# Altium schematic sheet IMX8_PWR.SchDoc
size 594 x 420 mm; SheetNumber: 2; SheetTotal: 7
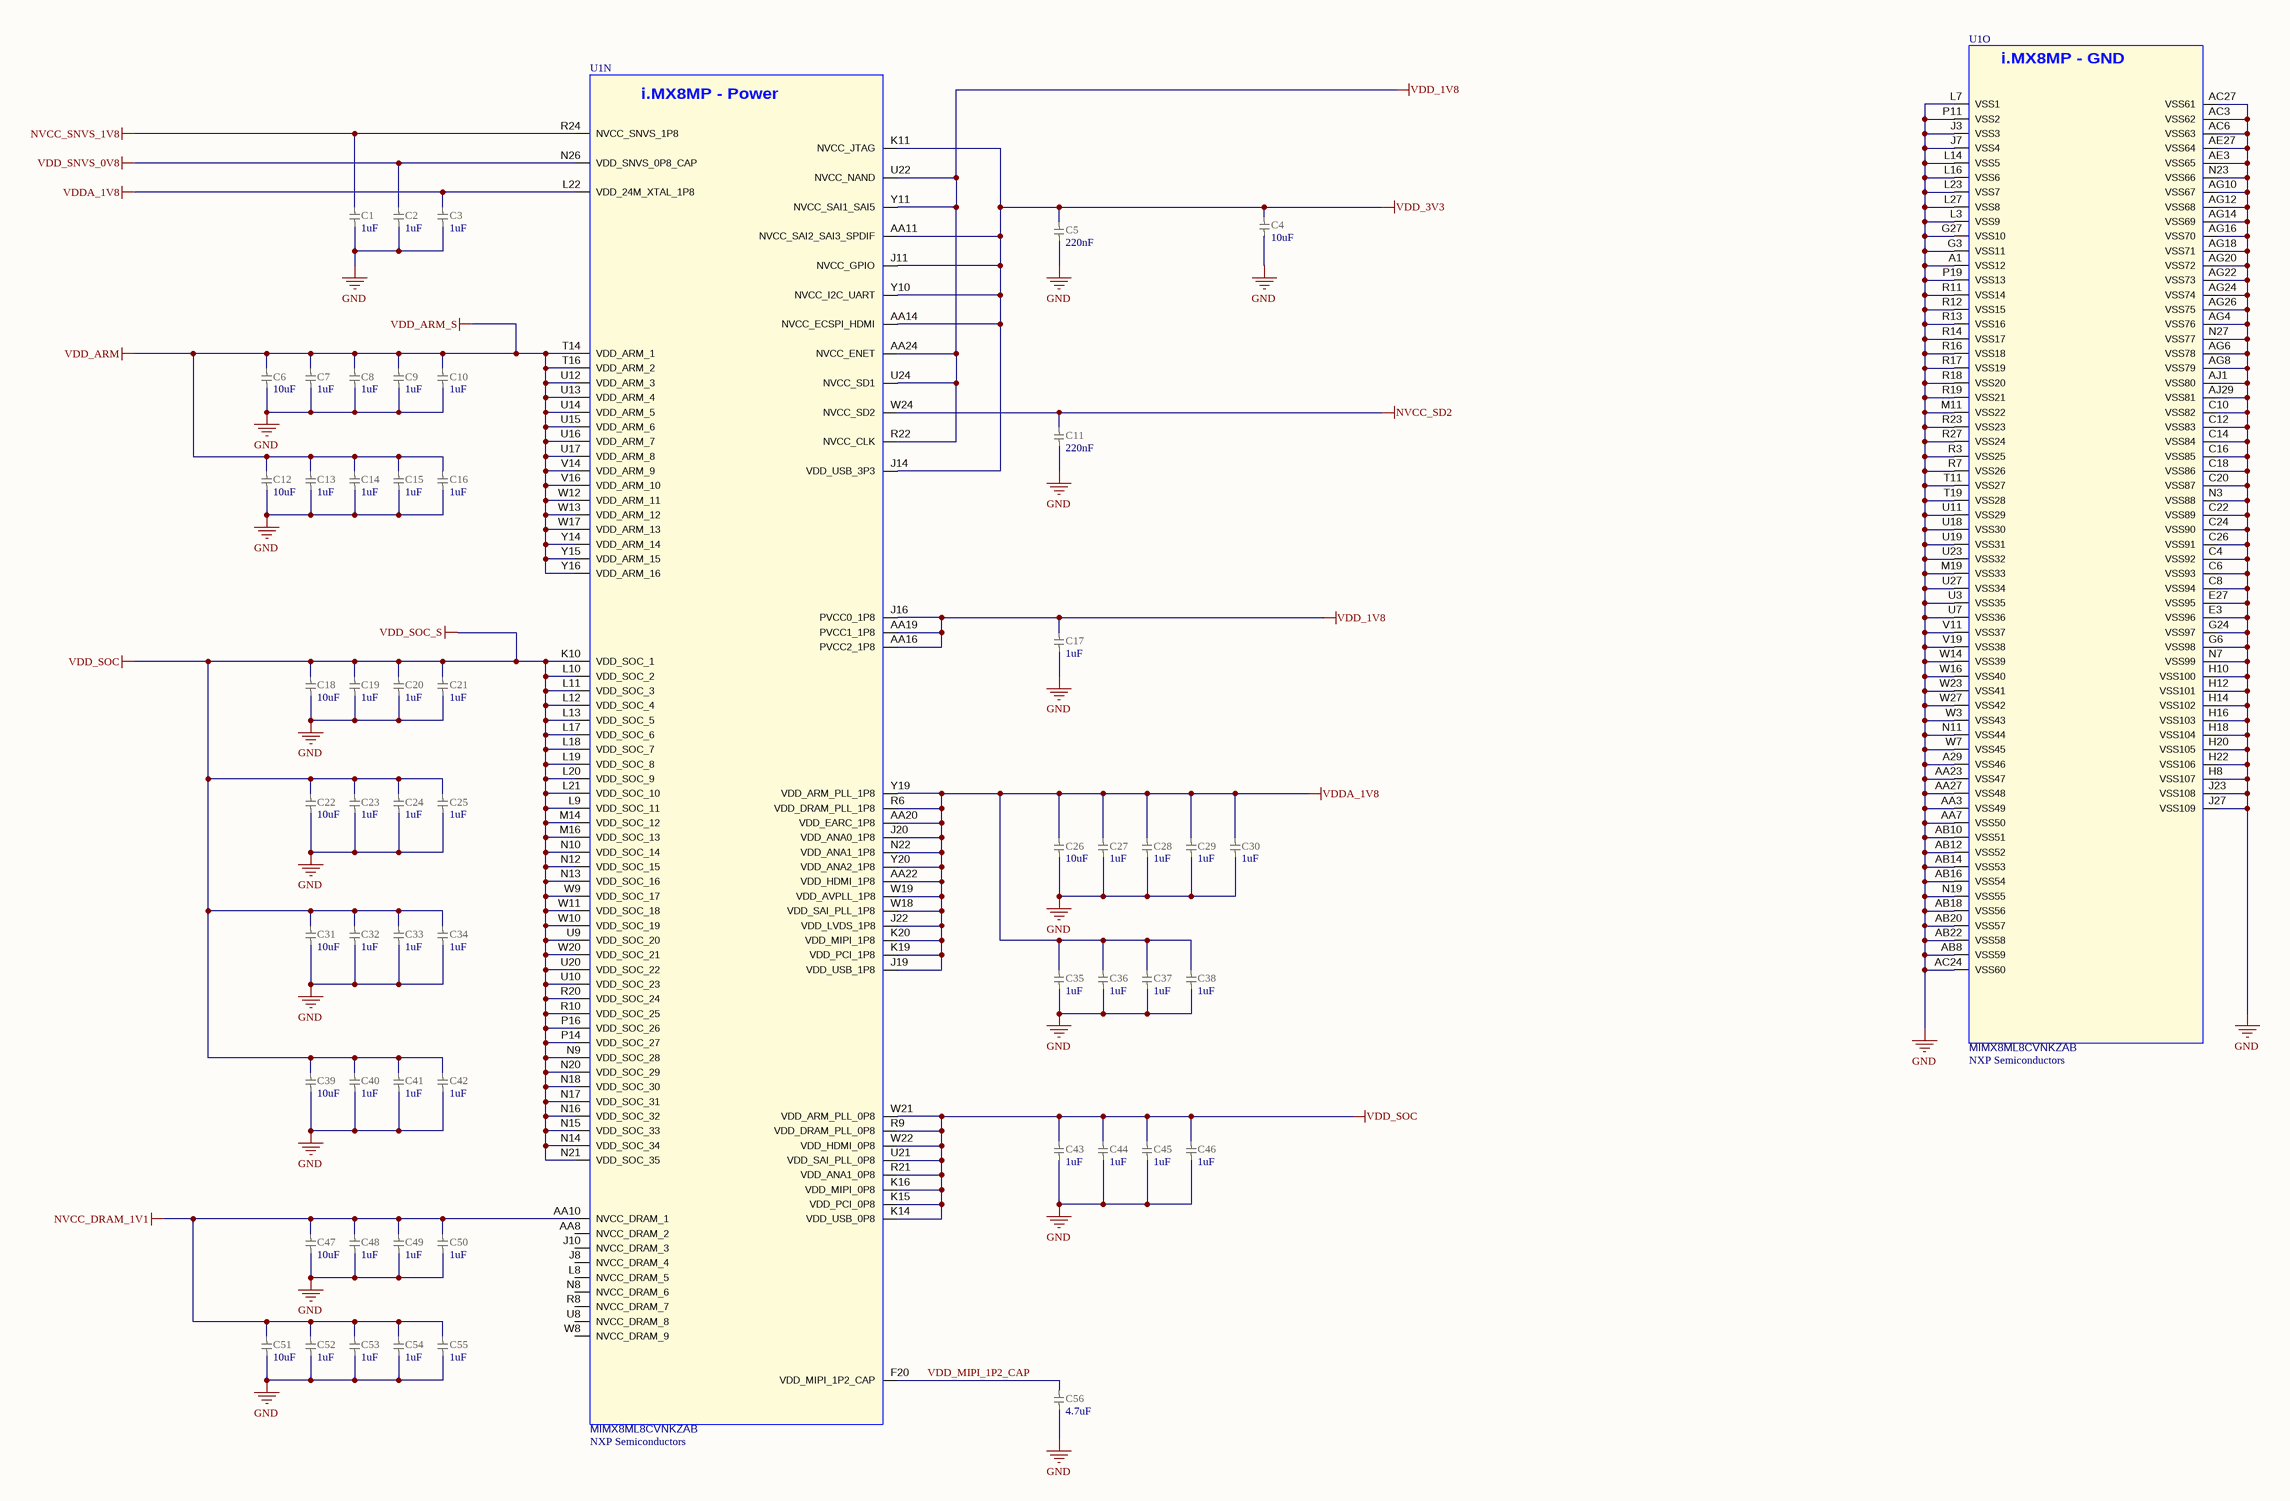
[diagram p0: IMX8_PWR.SchDoc]

## Parts
C1  value 1uF  [CAP_0201_UN1Q]  (hidden comment: CAP_0201_1uF_X6S)
C2  value 1uF  [CAP_0201_UN1Q]  (hidden comment: CAP_0201_1uF_X6S)
C3  value 1uF  [CAP_0201_UN1Q]  (hidden comment: CAP_0201_1uF_X6S)
C4  value 10uF  [CAP_0402_H09W07_UN1Q]  (hidden comment: CAP_0402_10u_X6S)
C5  value 220nF  [CAP_0201_UN1Q]  (hidden comment: CAP_0201_220n_10V_X6S)
C6  value 10uF  [CAP_0402_H09W07_UN1Q]  (hidden comment: CAP_0402_10u_X6S)
C7  value 1uF  [CAP_0201_UN1Q]  (hidden comment: CAP_0201_1uF_X6S)
C8  value 1uF  [CAP_0201_UN1Q]  (hidden comment: CAP_0201_1uF_X6S)
C9  value 1uF  [CAP_0201_UN1Q]  (hidden comment: CAP_0201_1uF_X6S)
C10  value 1uF  [CAP_0201_UN1Q]  (hidden comment: CAP_0201_1uF_X6S)
C11  value 220nF  [CAP_0201_UN1Q]  (hidden comment: CAP_0201_220n_10V_X6S)
C12  value 10uF  [CAP_0402_H09W07_UN1Q]  (hidden comment: CAP_0402_10u_X6S)
C13  value 1uF  [CAP_0201_UN1Q]  (hidden comment: CAP_0201_1uF_X6S)
C14  value 1uF  [CAP_0201_UN1Q]  (hidden comment: CAP_0201_1uF_X6S)
C15  value 1uF  [CAP_0201_UN1Q]  (hidden comment: CAP_0201_1uF_X6S)
C16  value 1uF  [CAP_0201_UN1Q]  (hidden comment: CAP_0201_1uF_X6S)
C17  value 1uF  [CAP_0201_UN1Q]  (hidden comment: CAP_0201_1uF_X6S)
C18  value 10uF  [CAP_0402_H09W07_UN1Q]  (hidden comment: CAP_0402_10u_X6S)
C19  value 1uF  [CAP_0201_UN1Q]  (hidden comment: CAP_0201_1uF_X6S)
C20  value 1uF  [CAP_0201_UN1Q]  (hidden comment: CAP_0201_1uF_X6S)
C21  value 1uF  [CAP_0201_UN1Q]  (hidden comment: CAP_0201_1uF_X6S)
C22  value 10uF  [CAP_0402_H09W07_UN1Q]  (hidden comment: CAP_0402_10u_X6S)
C23  value 1uF  [CAP_0201_UN1Q]  (hidden comment: CAP_0201_1uF_X6S)
C24  value 1uF  [CAP_0201_UN1Q]  (hidden comment: CAP_0201_1uF_X6S)
C25  value 1uF  [CAP_0201_UN1Q]  (hidden comment: CAP_0201_1uF_X6S)
C26  value 10uF  [CAP_0402_H09W07_UN1Q]  (hidden comment: CAP_0402_10u_X6S)
C27  value 1uF  [CAP_0201_UN1Q]  (hidden comment: CAP_0201_1uF_X6S)
C28  value 1uF  [CAP_0201_UN1Q]  (hidden comment: CAP_0201_1uF_X6S)
C29  value 1uF  [CAP_0201_UN1Q]  (hidden comment: CAP_0201_1uF_X6S)
C30  value 1uF  [CAP_0201_UN1Q]  (hidden comment: CAP_0201_1uF_X6S)
C31  value 10uF  [CAP_0402_H09W07_UN1Q]  (hidden comment: CAP_0402_10u_X6S)
C32  value 1uF  [CAP_0201_UN1Q]  (hidden comment: CAP_0201_1uF_X6S)
C33  value 1uF  [CAP_0201_UN1Q]  (hidden comment: CAP_0201_1uF_X6S)
C34  value 1uF  [CAP_0201_UN1Q]  (hidden comment: CAP_0201_1uF_X6S)
C35  value 1uF  [CAP_0201_UN1Q]  (hidden comment: CAP_0201_1uF_X6S)
C36  value 1uF  [CAP_0201_UN1Q]  (hidden comment: CAP_0201_1uF_X6S)
C37  value 1uF  [CAP_0201_UN1Q]  (hidden comment: CAP_0201_1uF_X6S)
C38  value 1uF  [CAP_0201_UN1Q]  (hidden comment: CAP_0201_1uF_X6S)
C39  value 10uF  [CAP_0402_H09W07_UN1Q]  (hidden comment: CAP_0402_10u_X6S)
C40  value 1uF  [CAP_0201_UN1Q]  (hidden comment: CAP_0201_1uF_X6S)
C41  value 1uF  [CAP_0201_UN1Q]  (hidden comment: CAP_0201_1uF_X6S)
C42  value 1uF  [CAP_0201_UN1Q]  (hidden comment: CAP_0201_1uF_X6S)
C43  value 1uF  [CAP_0201_UN1Q]  (hidden comment: CAP_0201_1uF_X6S)
C44  value 1uF  [CAP_0201_UN1Q]  (hidden comment: CAP_0201_1uF_X6S)
C45  value 1uF  [CAP_0201_UN1Q]  (hidden comment: CAP_0201_1uF_X6S)
C46  value 1uF  [CAP_0201_UN1Q]  (hidden comment: CAP_0201_1uF_X6S)
C47  value 10uF  [CAP_0402_H09W07_UN1Q]  (hidden comment: CAP_0402_10u_X6S)
C48  value 1uF  [CAP_0201_UN1Q]  (hidden comment: CAP_0201_1uF_X6S)
C49  value 1uF  [CAP_0201_UN1Q]  (hidden comment: CAP_0201_1uF_X6S)
C50  value 1uF  [CAP_0201_UN1Q]  (hidden comment: CAP_0201_1uF_X6S)
C51  value 10uF  [CAP_0402_H09W07_UN1Q]  (hidden comment: CAP_0402_10u_X6S)
C52  value 1uF  [CAP_0201_UN1Q]  (hidden comment: CAP_0201_1uF_X6S)
C53  value 1uF  [CAP_0201_UN1Q]  (hidden comment: CAP_0201_1uF_X6S)
C54  value 1uF  [CAP_0201_UN1Q]  (hidden comment: CAP_0201_1uF_X6S)
C55  value 1uF  [CAP_0201_UN1Q]  (hidden comment: CAP_0201_1uF_X6S)
C56  value 4.7uF  [CAP_0402_H09W07_UN1Q]  (hidden comment: CAP_0402_4u7_10V_X6S)
U1  Manufacturer: NXP Semiconductors  [BGA548C50P29X29_1500X1500X148]  (hidden comment: MIMX8ML8CVNKZAB)  (parts N,O of 15)

## Nets
GND: C1.1 C2.1 C3.1 C4.1 C5.1 C6.1 C7.1 C8.1 C9.1 C10.1 C11.1 C12.1 C13.1 C14.1 C15.1 C16.1 C17.1 C18.1 C19.1 C20.1 C21.1 C22.1 C23.1 C24.1 C25.1 C26.1 C27.1 C28.1 C29.1 C30.1 C31.1 C32.1 C33.1 C34.1 C35.1 C36.1 C37.1 C38.1 C39.1 C40.1 C41.1 C42.1 C43.1 C44.1 C45.1 C46.1 C47.1 C48.1 C49.1 C50.1 C51.1 C52.1 C53.1 C54.1 C55.1 C56.1 U1.A1(VSS12) U1.A29(VSS46) U1.AA3(VSS49) U1.AA7(VSS50) U1.AA23(VSS47) U1.AA27(VSS48) U1.AB8(VSS59) U1.AB10(VSS51) U1.AB12(VSS52) U1.AB14(VSS53) U1.AB16(VSS54) U1.AB18(VSS56) U1.AB20(VSS57) U1.AB22(VSS58) U1.AC3(VSS62) U1.AC6(VSS63) U1.AC24(VSS60) U1.AC27(VSS61) U1.AE3(VSS65) U1.AE27(VSS64) U1.AG4(VSS76) U1.AG6(VSS78) U1.AG8(VSS79) U1.AG10(VSS67) U1.AG12(VSS68) U1.AG14(VSS69) U1.AG16(VSS70) U1.AG18(VSS71) U1.AG20(VSS72) U1.AG22(VSS73) U1.AG24(VSS74) U1.AG26(VSS75) U1.AJ1(VSS80) U1.AJ29(VSS81) U1.C4(VSS92) U1.C6(VSS93) U1.C8(VSS94) U1.C10(VSS82) U1.C12(VSS83) U1.C14(VSS84) U1.C16(VSS85) U1.C18(VSS86) U1.C20(VSS87) U1.C22(VSS89) U1.C24(VSS90) U1.C26(VSS91) U1.E3(VSS96) U1.E27(VSS95) U1.G3(VSS11) U1.G6(VSS98) U1.G24(VSS97) U1.G27(VSS10) U1.H8(VSS107) U1.H10(VSS100) U1.H12(VSS101) U1.H14(VSS102) U1.H16(VSS103) U1.H18(VSS104) U1.H20(VSS105) U1.H22(VSS106) U1.J3(VSS3) U1.J7(VSS4) U1.J23(VSS108) U1.J27(VSS109) U1.L3(VSS9) U1.L7(VSS1) U1.L14(VSS5) U1.L16(VSS6) U1.L23(VSS7) U1.L27(VSS8) U1.M11(VSS22) U1.M19(VSS33) U1.N3(VSS88) U1.N7(VSS99) U1.N11(VSS44) U1.N19(VSS55) U1.N23(VSS66) U1.N27(VSS77) U1.P11(VSS2) U1.P19(VSS13) U1.R3(VSS25) U1.R7(VSS26) U1.R11(VSS14) U1.R12(VSS15) U1.R13(VSS16) U1.R14(VSS17) U1.R16(VSS18) U1.R17(VSS19) U1.R18(VSS20) U1.R19(VSS21) U1.R23(VSS23) U1.R27(VSS24) U1.T11(VSS27) U1.T19(VSS28) U1.U3(VSS35) U1.U7(VSS36) U1.U11(VSS29) U1.U18(VSS30) U1.U19(VSS31) U1.U23(VSS32) U1.U27(VSS34) U1.V11(VSS37) U1.V19(VSS38) U1.W3(VSS43) U1.W7(VSS45) U1.W14(VSS39) U1.W16(VSS40) U1.W23(VSS41) U1.W27(VSS42)
NVCC_DRAM_1V1: C47.2 C48.2 C49.2 C50.2 C51.2 C52.2 C53.2 C54.2 C55.2 U1.AA10(NVCC_DRAM_1)
NVCC_SD2: C11.2 U1.W24(NVCC_SD2)
NVCC_SNVS_1V8: C1.2 U1.R24(NVCC_SNVS_1P8)
VDD_1V8: C17.2 U1.AA16(PVCC2_1P8) U1.AA19(PVCC1_1P8) U1.AA24(NVCC_ENET) U1.J16(PVCC0_1P8) U1.R22(NVCC_CLK) U1.U22(NVCC_NAND) U1.U24(NVCC_SD1) U1.Y11(NVCC_SAI1_SAI5)
VDD_3V3: C4.2 C5.2 U1.AA11(NVCC_SAI2_SAI3_SPDIF) U1.AA14(NVCC_ECSPI_HDMI) U1.J11(NVCC_GPIO) U1.J14(VDD_USB_3P3) U1.K11(NVCC_JTAG) U1.Y10(NVCC_I2C_UART)
VDD_ARM: C6.2 C7.2 C8.2 C9.2 C10.2 C12.2 C13.2 C14.2 C15.2 C16.2 U1.T14(VDD_ARM_1) U1.T16(VDD_ARM_2) U1.U12(VDD_ARM_3) U1.U13(VDD_ARM_4) U1.U14(VDD_ARM_5) U1.U15(VDD_ARM_6) U1.U16(VDD_ARM_7) U1.U17(VDD_ARM_8) U1.V14(VDD_ARM_9) U1.V16(VDD_ARM_10) U1.W12(VDD_ARM_11) U1.W13(VDD_ARM_12) U1.W17(VDD_ARM_13) U1.Y14(VDD_ARM_14) U1.Y15(VDD_ARM_15) U1.Y16(VDD_ARM_16)  [also labelled VDD_ARM_S]
VDD_SNVS_0V8: C2.2 U1.N26(VDD_SNVS_0P8_CAP)
VDD_SOC: C18.2 C19.2 C20.2 C21.2 C22.2 C23.2 C24.2 C25.2 C31.2 C32.2 C33.2 C34.2 C39.2 C40.2 C41.2 C42.2 C43.2 C44.2 C45.2 C46.2 U1.K10(VDD_SOC_1) U1.K14(VDD_USB_0P8) U1.K15(VDD_PCI_0P8) U1.K16(VDD_MIPI_0P8) U1.L9(VDD_SOC_11) U1.L10(VDD_SOC_2) U1.L11(VDD_SOC_3) U1.L12(VDD_SOC_4) U1.L13(VDD_SOC_5) U1.L17(VDD_SOC_6) U1.L18(VDD_SOC_7) U1.L19(VDD_SOC_8) U1.L20(VDD_SOC_9) U1.L21(VDD_SOC_10) U1.M14(VDD_SOC_12) U1.M16(VDD_SOC_13) U1.N9(VDD_SOC_28) U1.N10(VDD_SOC_14) U1.N12(VDD_SOC_15) U1.N13(VDD_SOC_16) U1.N14(VDD_SOC_34) U1.N15(VDD_SOC_33) U1.N16(VDD_SOC_32) U1.N17(VDD_SOC_31) U1.N18(VDD_SOC_30) U1.N20(VDD_SOC_29) U1.N21(VDD_SOC_35) U1.P14(VDD_SOC_27) U1.P16(VDD_SOC_26) U1.R9(VDD_DRAM_PLL_0P8) U1.R10(VDD_SOC_25) U1.R20(VDD_SOC_24) U1.R21(VDD_ANA1_0P8) U1.U9(VDD_SOC_20) U1.U10(VDD_SOC_23) U1.U20(VDD_SOC_22) U1.U21(VDD_SAI_PLL_0P8) U1.W9(VDD_SOC_17) U1.W10(VDD_SOC_19) U1.W11(VDD_SOC_18) U1.W20(VDD_SOC_21) U1.W21(VDD_ARM_PLL_0P8) U1.W22(VDD_HDMI_0P8)  [also labelled VDD_SOC_S]
VDDA_1V8: C3.2 C26.2 C27.2 C28.2 C29.2 C30.2 C35.2 C36.2 C37.2 C38.2 U1.AA20(VDD_EARC_1P8) U1.AA22(VDD_HDMI_1P8) U1.J19(VDD_USB_1P8) U1.J20(VDD_ANA0_1P8) U1.J22(VDD_LVDS_1P8) U1.K19(VDD_PCI_1P8) U1.K20(VDD_MIPI_1P8) U1.L22(VDD_24M_XTAL_1P8) U1.N22(VDD_ANA1_1P8) U1.R6(VDD_DRAM_PLL_1P8) U1.W18(VDD_SAI_PLL_1P8) U1.W19(VDD_AVPLL_1P8) U1.Y19(VDD_ARM_PLL_1P8) U1.Y20(VDD_ANA2_1P8)
VDD_MIPI_1P2_CAP: C56.2 U1.F20(VDD_MIPI_1P2_CAP)

Not connected (* = marked no-connect by the designer): U1 AA8(NVCC_DRAM_2) J8(NVCC_DRAM_4) J10(NVCC_DRAM_3) L8(NVCC_DRAM_5) N8(NVCC_DRAM_6) R8(NVCC_DRAM_7) U8(NVCC_DRAM_8) W8(NVCC_DRAM_9)

## Notes on the sheet
- DWG NO:
- REV:
- THIS DOCUMENT AND THE DATA DISCLOSED HEREIN OR
- HEREWITH IS THE PROPERTY OF ALTIUM LIMITED AND MAY
- BE FREELY DISTRIBUTED IN WHOLE. NO RIGHTS ARE
- RESERVED OR EXPRESS OR IMPLIED WARANTEE GIVEN.
- REVISION
- DESCRIPTION
- DATE
- APPROVED
- ENG:
- APPROVALS
- PROJECT
- DSN:
- CHK:
- REFERENCE DOCUMENTS
- PROJECT REVISION:
- TITLE
- DOCUMENT REVISION:
- DESIGN ITEM:
- BOM:
- FAB DWG:
- PCB DWG:
- ASSY DWG:
- SCALE:
- A2
- SIZE
- CAGE CODE
- FILE NAME
- DWG NO.
- SHEET
- OF
- REV
- (in symbol CMP-001-000983-8, part N) i.MX8MP - Power
- (in symbol CMP-001-000983-8, part O) i.MX8MP - GND

## Library data of the parts
C1-C3 C7-C10 C13-C17 C19-C21 C23-C25 C27-C30 C32-C38 C40-C46 C48-C50 C52-C55 = CMP-001-000336-15: CAP; Part Number: KGM03CS61A105MH; Manufacturer: Kyocera; Manufacturer: Kyocera AVX; Temperature characteristics: X6S; Voltage: 10V; Tolerance: +/-20%; Sort order: 302; HasBeenBuilt: False; Alternative component: Allowed; System: RLC; Package: 0201; Operating temperature range: -55C to +105C; ClassName: SMALL; ComponentLink1Description: 1_Datasheet; ComponentLink2Description: 2_Product page; ComponentLink3Description: 3_X-information; ComponentLink4Description: 4_X-information; Creation date: 20190101; Source: RLC_UN1Q.SchLib; Manufacturer Part Number: KGM03CS61A105MH; Component Type: Capacitor
C4 C6 C12 C18 C22 C26 C31 C39 C47 C51 = CMP-001-000883-14: CAP; Part Number: GMC04X6S106M6R3NT; Manufacturer: Cal-Chip Electronics, Inc.; Manufacturer: Cal-Chip Electronics; Voltage: 6.3V; Tolerance: +/-20%; Temperature characteristics: X6S; Sort order: 304; HasBeenBuilt: TBD; Alternative component: Allowed; System: RLC; Package: 0402; ComponentLink1Description: 1_Datasheet; ComponentLink2Description: 2_Product page; ComponentLink3Description: 3_X-information; ComponentLink4Description: 4_X-information; Creation date: 26042024; Manufacturer Part Number: GMC04X6S106M6R3NT; Component Type: Capacitor
C5 C11 = CMP-001-000889-11: CAP; Part Number: GRM033C81A224KE01D; Manufacturer: Murata; Temperature characteristics: X6S; Voltage: 10V; Tolerance: +/-20%; Sort order: 302; HasBeenBuilt: TBD; Alternative component: Allowed; System: RLC; Package: 0201; Dimensions WxLxH: 0.35; ComponentLink1Description: 1_Datasheet; ComponentLink2Description: 2_Product page; ComponentLink3Description: 3_X-information; ComponentLink4Description: 4_X-information; Creation date: 26042024; ClassName: SMALL; Manufacturer Part Number: GRM033C81A224KE01D; Component Type: Capacitor
C56 = CMP-001-000888-12: CAP; Part Number: GRT155C81A475ME13J; Manufacturer: Murata; Sort order: 304; HasBeenBuilt: TBD; Alternative component: Allowed; System: RLC; Voltage: 10V; Temperature characteristics: X6S; Tolerance: +/-10%; ComponentLink2Description: 2_Product page; Package: 0402; Creation date: 26042024; ComponentLink1Description: 1_Datasheet; ComponentLink3Description: 3_X-information; ComponentLink4Description: 4_X-information; Manufacturer Part Number: GRT155C81A475ME13J; Component Type: Capacitor
U1 = CMP-001-000983-8: CPU QUAD CORTEX A53+M4 1.6GHZ BGA548 Industrial; Sort order: 501; System: IC; ComponentLink1Description: 1_Datasheet; ComponentLink1URL: https://www.nxp.com/part/MIMX8ML8CVNKZAB#/; ComponentLink2Description: 2_Product page; ComponentLink3Description: 3_X-information; ComponentLink4Description: 4_X-information; Creation date: 20240524; Dimensions WxLxH: 15 x 15 x 1.33mm; Manufacturer: NXP SEMICONDUCTORS; Operating temperature range: -40... +105 °C; Package: FCBGA548; Part Number: MIMX8ML8CVNKZAB; ClassName: BIG; Source: UUDET_KOMPONENTIT.SchLib; Design Item ID: MIMX8ML8CVNKZAB; Manufacturer Part Number: MIMX8ML8CVNKZAB; Component Type: Processor